# Altium schematic sheet 电机控制.SchDoc
size A4
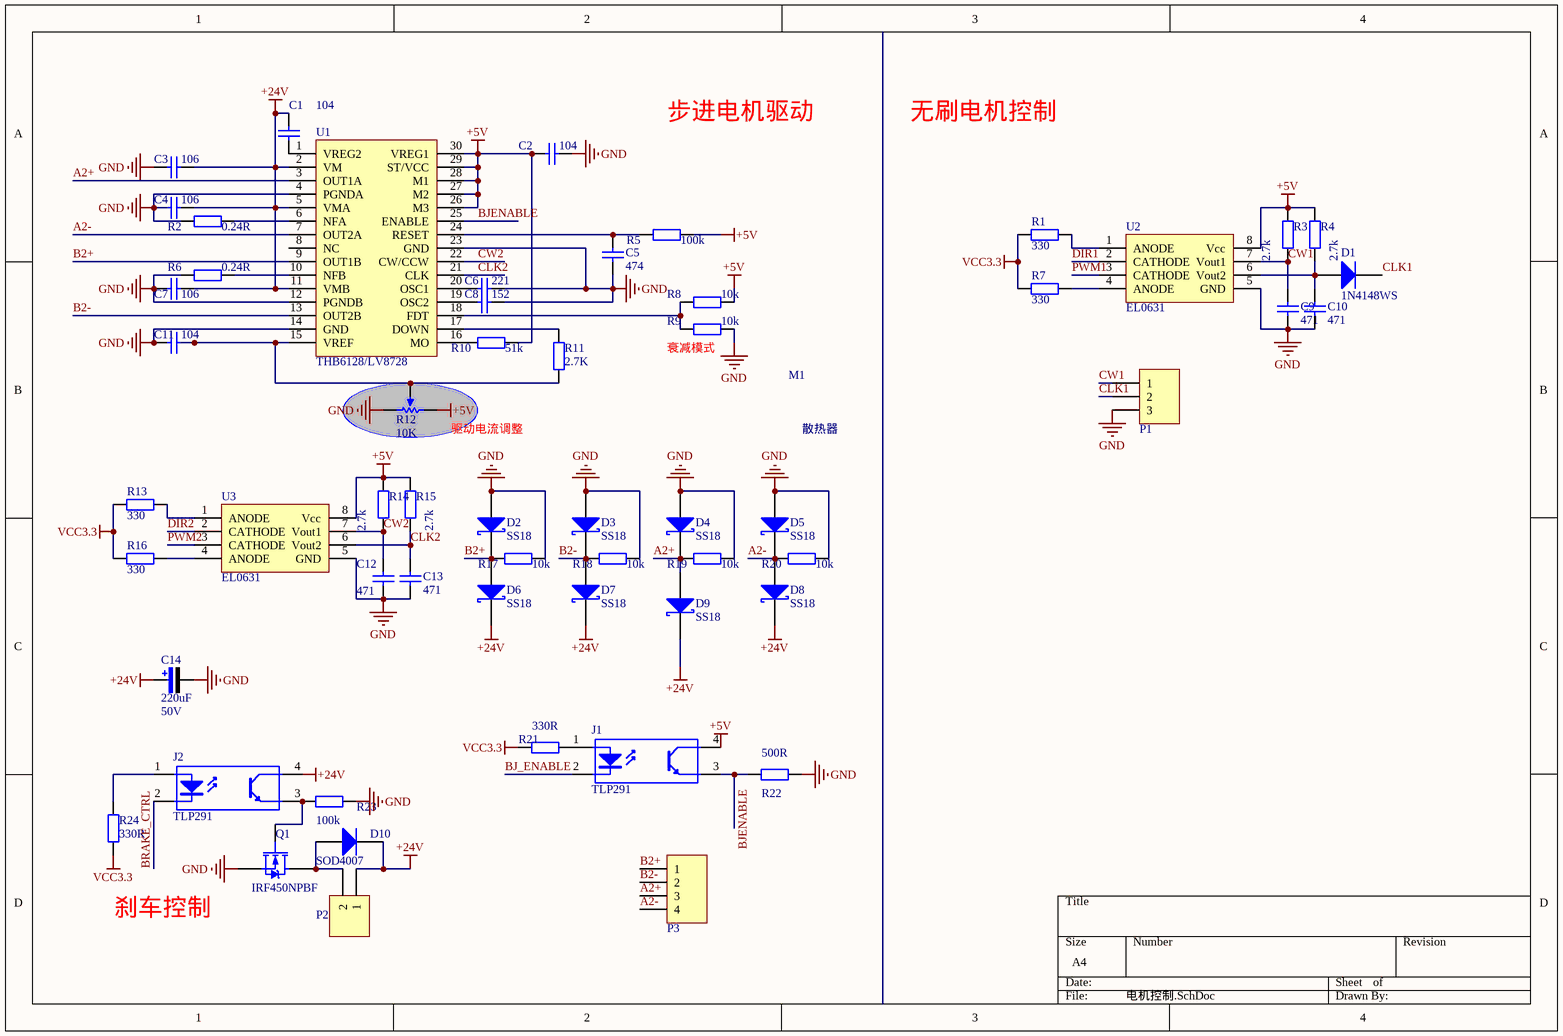
[diagram p0: 电机控制.SchDoc]

## Parts
C1  value 104  [C-RAD-0603]  (hidden comment: Cap)
C2  value 104  [C-RAD-0603]  (hidden comment: Cap)
C3  value 106  [C-RAD-0603]  (hidden comment: Cap)
C4  value 106  [C-RAD-0603]  (hidden comment: Cap)
C5  value 474  [C-RAD-0603]  (hidden comment: Cap)
C6  value 221  [C-RAD-0603]  (hidden comment: Cap)
C7  value 106  [C-RAD-0603]  (hidden comment: Cap)
C8  value 152  [C-RAD-0603]  (hidden comment: Cap)
C9  value 471  [C-RAD-0603]  (hidden comment: Cap)
C10  value 471  [C-RAD-0603]  (hidden comment: Cap)
C11  value 104  [C-RAD-0603]  (hidden comment: Cap)
C12  value 471  [C-RAD-0603]  (hidden comment: Cap)
C13  value 471  [C-RAD-0603]  (hidden comment: Cap)
C14  value 220uF  Vol: 50V  [C-RB-S10]  (hidden comment: Cap Pol)
D1  Type: 1N4148WS  [SOD323]  (hidden comment: Diode)
D2  Type: SS18  [DIODE-SMA]  (hidden comment: D-Schottky)
D3  Type: SS18  [DIODE-SMA]  (hidden comment: D-Schottky)
D4  Type: SS18  [DIODE-SMA]  (hidden comment: D-Schottky)
D5  Type: SS18  [DIODE-SMA]  (hidden comment: D-Schottky)
D6  Type: SS18  [DIODE-SMA]  (hidden comment: D-Schottky)
D7  Type: SS18  [DIODE-SMA]  (hidden comment: D-Schottky)
D8  Type: SS18  [DIODE-SMA]  (hidden comment: D-Schottky)
D9  Type: SS18  [DIODE-SMA]  (hidden comment: D-Schottky)
D10  Type: SOD4007  [SOD123]  (hidden comment: Diode)
J1  TLP291  [SOP127P710X350-4N]
J2  TLP291  [SOP127P710X350-4N]
M1  散热器  [26*26*10对角37.5]
P1  Header 3  [XH2.54*3卧贴]  (value not drawn)
P2  Header 2  [XH2.54*2卧贴]  (value not drawn)
P3  Header 4  [XH2.54*4卧贴]  (value not drawn)
Q1  IRF450NPBF  [TO-263-2]
R1  value 330  [0603-1]  (hidden comment: Res1)
R2  value 0.24R  [2512]  (hidden comment: Res1)
R3  value 2.7k  [0603-1]  (hidden comment: Res1)
R4  value 2.7k  [0603-1]  (hidden comment: Res1)
R5  value 100k  [0603-1]  (hidden comment: Res1)
R6  value 0.24R  [2512]  (hidden comment: Res1)
R7  value 330  [0603-1]  (hidden comment: Res1)
R8  value 10k  [0603-1]  (hidden comment: Res1)
R9  value 10k  [0603-1]  (hidden comment: Res1)
R10  value 51k  [0603-1]  (hidden comment: Res1)
R11  value 2.7K  [0603-1]  (hidden comment: Res1)
R12  value 10K  [VR-3266W]  (hidden comment: RPot)
R13  value 330  [0603-1]  (hidden comment: Res1)
R14  value 2.7k  [0603-1]  (hidden comment: Res1)
R15  value 2.7k  [0603-1]  (hidden comment: Res1)
R16  value 330  [0603-1]  (hidden comment: Res1)
R17  value 10k  [0603-1]  (hidden comment: Res1)
R18  value 10k  [0603-1]  (hidden comment: Res1)
R19  value 10k  [0603-1]  (hidden comment: Res1)
R20  value 10k  [0603-1]  (hidden comment: Res1)
R21  value 330R  [0603-1]  (hidden comment: Res1)
R22  value 500R  [0603-1]  (hidden comment: Res1)
R23  value 100k  [0603-1]  (hidden comment: Res1)
R24  value 330R  [0603-1]  (hidden comment: Res1)
U1  THB6128/LV8728  [SIOC-30-W]
U2  EL0631  [EL0631]
U3  EL0631  [EL0631]

## Nets
+5V: C2.1 J1.4(C) R3.2 R4.2 R5.2 R8.2 R10.2 R12.1(TOP) R14.2 R15.2 U1.26(M3) U1.27(M2) U1.28(M1) U1.29(ST/VCC) U1.30(VREG1) U2.8(Vcc) U3.8(Vcc)
+24V: C1.1 C3.2 C4.2 C7.2 C14.1 D6.2(K) D7.2(K) D8.2(K) D9.2(K) D10.2(K) J2.4(C) P2.1 U1.2(VM) U1.5(VMA) U1.11(VMB)
GND: C2.2 C3.1 C4.1 C5.1 C6.2 C7.1 C8.2 C9.1 C10.1 C11.1 C12.1 C13.1 C14.2 D2.1(A) D3.1(A) D4.1(A) D5.1(A) P1.3 Q1.2(S) R2.1 R6.2 R9.2 R12.3(BOT) R17.2 R18.2 R19.2 R20.2 R22.1 R23.1 U1.4(PGNDA) U1.12(PGNDB) U1.14(GND) U1.23(GND) U2.5(GND) U3.5(GND)
VCC3.3: R1.2 R7.2 R13.2 R16.2 R21.2 R24.2
A2+: D4.2(K) D9.1(A) P3.3 R19.1 U1.3(OUT1A)
A2-: D5.2(K) D8.1(A) P3.4 R20.1 U1.7(OUT2A)
B2+: D2.2(K) D6.1(A) P3.1 R17.1 U1.9(OUT1B)
B2-: D3.2(K) D7.1(A) P3.2 R18.1 U1.13(OUT2B)
BJ_ENABLE: J1.2(K)
BJENABLE: J1.3(E) R22.2 U1.25(ENABLE)
BRAKE_CTRL: J2.2(K)
CLK1: D1.2(K) P1.2
CLK2: C13.2 R15.1 U1.21(CLK) U3.6(Vout2)
CW1: C9.2 P1.1 R3.1 U2.7(Vout1)
CW2: C12.2 R14.1 U1.22(CW/CCW) U3.7(Vout1)
DIR1: U2.2(CATHODE)
DIR2: U3.2(CATHODE)
PWM1: U2.3(CATHODE)
PWM2: U3.3(CATHODE)
NetC1_2: C1.2 U1.1(VREG2)
NetC5_2: C5.2 R5.1 U1.24(RESET)
NetC6_1: C6.1 U1.20(OSC1)
NetC8_1: C8.1 U1.19(OSC2)
NetC10_2: C10.2 D1.1(A) R4.1 U2.6(Vout2)
NetC11_2: C11.2 R11.2 R12.2(TAP) U1.15(VREF)
NetD10_1: D10.1(A) P2.2 Q1.3(D)
NetJ1_1: J1.1(A) R21.1
NetJ2_1: J2.1(A) R24.1
NetJ2_3: J2.3(E) Q1.1(G) R23.2
NetR1_1: R1.1 U2.1(ANODE)
NetR2_2: R2.2 U1.6(NFA)
NetR6_1: R6.1 U1.10(NFB)
NetR7_1: R7.1 U2.4(ANODE)
NetR8_1: R8.1 R9.1 U1.18(FDT)
NetR10_1: R10.1 U1.16(MO)
NetR11_1: R11.1 U1.17(DOWN)
NetR13_1: R13.1 U3.1(ANODE)
NetR16_1: R16.1 U3.4(ANODE)

Not connected (* = marked no-connect by the designer): U1 8(NC)

## Notes on the sheet
- 步进电机驱动
- 无刷电机控制
- (near R9) 衰减模式
- (near R12) 驱动电流调整
- 刹车控制

## Library data of the parts
C1-C13 = Cap: 无极性电容; Published: 8-Jun-2000; LatestRevisionDate: 17-Jul-2002; LatestRevisionNote: Re-released for DXP Platform.; PackageReference: RAD-0.3; Publisher: Altium Limited
C14 = Cap Pol: 极性电解电容; Published: 8-Jun-2000; LatestRevisionDate: 17-Jul-2002; LatestRevisionNote: Re-released for DXP Platform.; PackageReference: RB7.6-15; Publisher: Altium Limited
D1 D10 = Diode: 二极管; Published: 8-Jun-2000; LatestRevisionDate: 17-Jul-2002; LatestRevisionNote: Re-released for DXP Platform.; PackageDocument: Sep-1996; PackageReference: SMC; Publisher: Altium Limited; Code_JEDEC: DO-214-AB
D2-D9 = D-Schottky: 肖特基二极管; Published: 8-Jun-2000; LatestRevisionDate: 17-Jul-2002; LatestRevisionNote: Re-released for DXP Platform.; PackageReference: SMB; Publisher: Altium Limited; Code_JEDEC: DO-214-AA
J1 J2 = TLP281: 光耦; Published: 24-Mar-1999; LatestRevisionDate: 04-Mar-2005; LatestRevisionNote: Sch pins 3 & 4 Swapped.; DatasheetDocument: Nov-2003; PackageReference: DIP-4; Publisher: Altium Limited
M1 = 26*26*10散热器: 26*26*10MM散热器孔距37MM; 链接: https://item.taobao.com/item.htm?spm=a1z10.5-c.w4002-16073799567.19.6c7860d7hcre0b&id=550027229822
P1 = Header 3: 接插件; LatestRevisionDate: 17-Jul-2002; LatestRevisionNote: Re-released for DXP Platform.; Publisher: Altium Limited
P2 = Header 2: 接插件; LatestRevisionDate: 17-Jul-2002; LatestRevisionNote: Re-released for DXP Platform.; Publisher: Altium Limited
P3 = Header 4: 接插件; LatestRevisionDate: 17-Jul-2002; LatestRevisionNote: Re-released for DXP Platform.; Publisher: Altium Limited
Q1 = MOSFET-N: N-Channel MOSFET; PackageDocument: 1995/1996; Published: 8-Jun-2000; LatestRevisionDate: 17-Jul-2002; LatestRevisionNote: Re-released for DXP Platform.; PackageReference: E3; Publisher: Altium Limited
R1-R11 R13-R24 = Res1: 贴片电阻; Published: 8-Jun-2000; LatestRevisionDate: 17-Jul-2002; LatestRevisionNote: Re-released for DXP Platform.; PackageReference: AXIAL-0.4; Publisher: Altium Limited
R12 = RPot: 精密可调电阻; Sim Note: Enter the Resistance value and the set point into parameter fields.; Set Position: 0.5; Published: 8-Jun-2000; LatestRevisionDate: 17-Jul-2002; LatestRevisionNote: Re-released for DXP Platform.; PackageReference: VR5; Publisher: Altium Limited
U1 = THB6128: 步进电机驱动
U2 U3 = EL0631: 双路隔离光耦